# EAGLE design untitled (EAGLE 5.07)
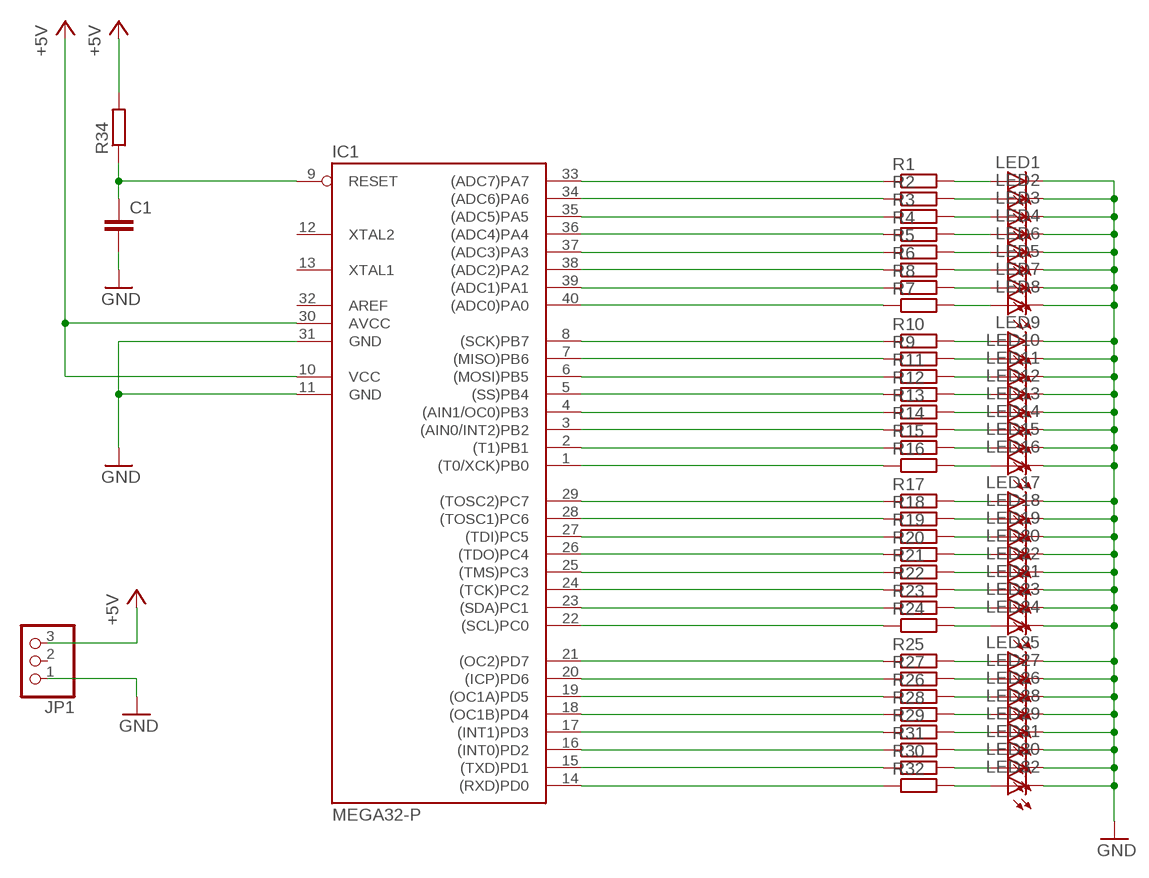
[diagram p0: schematic, sheet 1]

## Parts
C1  C-EU050-024X044  [C050-024X044]
IC1  MEGA32-P  [DIL40]
JP1  PINHD-1X3  [1X03]
LED1  LED5MM  [LED5MM]
LED2  LED5MM  [LED5MM]
LED3  LED5MM  [LED5MM]
LED4  LED5MM  [LED5MM]
LED5  LED5MM  [LED5MM]
LED6  LED5MM  [LED5MM]
LED7  LED5MM  [LED5MM]
LED8  LED5MM  [LED5MM]
LED9  LED5MM  [LED5MM]
LED10  LED5MM  [LED5MM]
LED11  LED5MM  [LED5MM]
LED12  LED5MM  [LED5MM]
LED13  LED5MM  [LED5MM]
LED14  LED5MM  [LED5MM]
LED15  LED5MM  [LED5MM]
LED16  LED5MM  [LED5MM]
LED17  LED5MM  [LED5MM]
LED18  LED5MM  [LED5MM]
LED19  LED5MM  [LED5MM]
LED20  LED5MM  [LED5MM]
LED21  LED5MM  [LED5MM]
LED22  LED5MM  [LED5MM]
LED23  LED5MM  [LED5MM]
LED24  LED5MM  [LED5MM]
LED25  LED5MM  [LED5MM]
LED26  LED5MM  [LED5MM]
LED27  LED5MM  [LED5MM]
LED28  LED5MM  [LED5MM]
LED29  LED5MM  [LED5MM]
LED30  LED5MM  [LED5MM]
LED31  LED5MM  [LED5MM]
LED32  LED5MM  [LED5MM]
R1  R-EU_0204/7  [0204/7]
R2  R-EU_0204/7  [0204/7]
R3  R-EU_0204/7  [0204/7]
R4  R-EU_0204/7  [0204/7]
R5  R-EU_0204/7  [0204/7]
R6  R-EU_0204/7  [0204/7]
R7  R-EU_0204/7  [0204/7]
R8  R-EU_0204/7  [0204/7]
R9  R-EU_0204/7  [0204/7]
R10  R-EU_0204/7  [0204/7]
R11  R-EU_0204/7  [0204/7]
R12  R-EU_0204/7  [0204/7]
R13  R-EU_0204/7  [0204/7]
R14  R-EU_0204/7  [0204/7]
R15  R-EU_0204/7  [0204/7]
R16  R-EU_0204/7  [0204/7]
R17  R-EU_0204/7  [0204/7]
R18  R-EU_0204/7  [0204/7]
R19  R-EU_0204/7  [0204/7]
R20  R-EU_0204/7  [0204/7]
R21  R-EU_0204/7  [0204/7]
R22  R-EU_0204/7  [0204/7]
R23  R-EU_0204/7  [0204/7]
R24  R-EU_0204/7  [0204/7]
R25  R-EU_0204/7  [0204/7]
R26  R-EU_0204/7  [0204/7]
R27  R-EU_0204/7  [0204/7]
R28  R-EU_0204/7  [0204/7]
R29  R-EU_0204/7  [0204/7]
R30  R-EU_0204/7  [0204/7]
R31  R-EU_0204/7  [0204/7]
R32  R-EU_0204/7  [0204/7]
R34  R-EU_0204/7  [0204/7]

## Nets
+5V: IC1.10(VCC) IC1.30(AVCC) JP1.3 R34.2
GND: C1.2 IC1.11(GND) IC1.31(GND) JP1.1 LED1.K(C) LED2.K(C) LED3.K(C) LED4.K(C) LED5.K(C) LED6.K(C) LED7.K(C) LED8.K(C) LED9.K(C) LED10.K(C) LED11.K(C) LED12.K(C) LED13.K(C) LED14.K(C) LED15.K(C) LED16.K(C) LED17.K(C) LED18.K(C) LED19.K(C) LED20.K(C) LED21.K(C) LED22.K(C) LED23.K(C) LED24.K(C) LED25.K(C) LED26.K(C) LED27.K(C) LED28.K(C) LED29.K(C) LED30.K(C) LED31.K(C) LED32.K(C)
N$1: LED32.A R32.2
N$2: LED30.A R30.2
N$3: LED31.A R31.2
N$4: LED29.A R29.2
N$5: LED28.A R28.2
N$6: LED26.A R26.2
N$7: LED27.A R27.2
N$8: LED25.A R25.2
N$9: LED24.A R24.2
N$10: LED23.A R23.2
N$11: LED21.A R22.2
N$12: LED22.A R21.2
N$13: LED20.A R20.2
N$14: LED19.A R19.2
N$15: LED18.A R18.2
N$16: LED17.A R17.2
N$17: LED16.A R16.2
N$18: LED15.A R15.2
N$19: LED14.A R14.2
N$20: LED13.A R13.2
N$21: LED12.A R12.2
N$22: LED11.A R11.2
N$23: LED10.A R9.2
N$24: LED9.A R10.2
N$25: LED8.A R7.2
N$26: LED7.A R8.2
N$27: LED5.A R6.2
N$28: LED6.A R5.2
N$29: LED4.A R4.2
N$30: LED3.A R3.2
N$31: LED2.A R2.2
N$32: LED1.A R1.2
N$33: IC1.33((ADC7)PA7) R1.1
N$34: IC1.34((ADC6)PA6) R2.1
N$35: IC1.35((ADC5)PA5) R3.1
N$36: IC1.36((ADC4)PA4) R4.1
N$37: IC1.37((ADC3)PA3) R5.1
N$38: IC1.38((ADC2)PA2) R6.1
N$39: IC1.39((ADC1)PA1) R8.1
N$40: IC1.40((ADC0)PA0) R7.1
N$41: IC1.8((SCK)PB7) R10.1
N$42: IC1.7((MISO)PB6) R9.1
N$43: IC1.6((MOSI)PB5) R11.1
N$44: IC1.5((SS)PB4) R12.1
N$45: IC1.4((AIN1/OC0)PB3) R13.1
N$46: IC1.3((AIN0/INT2)PB2) R14.1
N$47: IC1.2((T1)PB1) R15.1
N$48: IC1.1((T0/XCK)PB0) R16.1
N$49: IC1.29((TOSC2)PC7) R17.1
N$50: IC1.28((TOSC1)PC6) R18.1
N$51: IC1.27((TDI)PC5) R19.1
N$52: IC1.26((TDO)PC4) R20.1
N$53: IC1.25((TMS)PC3) R21.1
N$54: IC1.24((TCK)PC2) R22.1
N$55: IC1.23((SDA)PC1) R23.1
N$56: IC1.22((SCL)PC0) R24.1
N$57: IC1.21((OC2)PD7) R25.1
N$58: IC1.20((ICP)PD6) R27.1
N$59: IC1.19((OC1A)PD5) R26.1
N$60: IC1.18((OC1B)PD4) R28.1
N$61: IC1.17((INT1)PD3) R29.1
N$62: IC1.16((INT0)PD2) R31.1
N$63: IC1.15((TXD)PD1) R30.1
N$64: IC1.14((RXD)PD0) R32.1
N$65: C1.1 IC1.9(RESET) R34.1
Unconnected: IC1.12(XTAL2) IC1.13(XTAL1) IC1.32(AREF) JP1.2

## Library data of the parts
C1 = rcl:C-EU: CAPACITOR, European symbol
IC1 = atmel:MEGA32-P: MICROCONTROLLER 32 Kbytes FLASH 2 Kbytes SRAM 1 Kbytes EEPROM USART 8-channel 10 bit ADC Source: www.atmel.com .. doc2503.pdf
JP1 = pinhead:PINHD-1X3: PIN HEADER
LED1-LED32 = led:LED: LED OSRAM: - CHIPLED LG R971, LG N971, LY N971, LG Q971, LY Q971, LO R971, LY R971 LH N974, LH R974 LS Q976, LO Q976, LY Q976 LO Q996 - Hyper CHIPLED LW Q18S LB Q993, LB Q99A, LB R99A - SideLED LS A670, LO A670, LY A670, LG A670, LP A670 LB A673, LV A673, LT A673, LW A673 LH A674 LY A675 LS A676, LA A676, LO A676, LY A676, LW A676 LS A679, LY A679, LG A679 - Hyper Micro SIDELED® LS Y876, LA Y876, LO Y876, LY Y876 LT Y87S - SmartLED LW L88C, LW L88S LB L89C, LB L89S, LG L890 LS L89K, LO L89K, LY L89K LS L896, LA L896, LO L896, LY L896 - TOPLED LS T670, LO T670, LY T670, LG T670, LP T670 LSG T670, LSP T670, LSY T670, LOP T670, LYG T670 LG T671, LOG T671, LSG T671 LB T673, LV T673, LT T673, LW T673 LH T674 LS T676, LA T676, LO T676, LY T676, LB T676, LH T676, LSB T676, LW T676 LB T67C, LV T67C, LT T67C, LS T67K, LO T67K, LY T67K, LW E67C LS E67B, LA E67B, LO E67B, LY E67B, LB E67C, LV E67C, LT E67C LW T67C LS T679, LY T679, LG T679 LS T770, LO T770, LY T770, LG T770, LP T770 LB T773, LV T773, LT T773, LW T773 LH T774 LS E675, LA E675, LY E675, LS T675 LS T776, LA T776, LO T776, LY T776, LB T776 LHGB T686 LT T68C, LB T68C - Hyper Mini TOPLED® LB M676 - Mini TOPLED Santana® LG M470 LS M47K, LO M47K, LY M47K Source: http://www.osram.convergy.de LUXEON: - LUMILED® LXK2-PW12-R00, LXK2-PW12-S00, LXK2-PW14-U00, LXK2-PW14-V00 LXK2-PM12-R00, LXK2-PM12-S00, LXK2-PM14-U00 LXK2-PE12-Q00, LXK2-PE12-R00, LXK2-PE12-S00, LXK2-PE14-T00, LXK2-PE14-U00 LXK2-PB12-K00, LXK2-PB12-L00, LXK2-PB12-M00, LXK2-PB14-N00, LXK2-PB14-P00, LXK2-PB14-Q00 LXK2-PR12-L00, LXK2-PR12-M00, LXK2-PR14-Q00, LXK2-PR14-R00 LXK2-PD12-Q00, LXK2-PD12-R00, LXK2-PD12-S00 LXK2-PH12-R00, LXK2-PH12-S00 LXK2-PL12-P00, LXK2-PL12-Q00, LXK2-PL12-R00 Source: www.luxeon.com KINGBRIGHT: KA-3528ASYC Source: www.kingbright.com
R1-R32 R34 = rcl:R-EU_: RESISTOR, European symbol

## Board
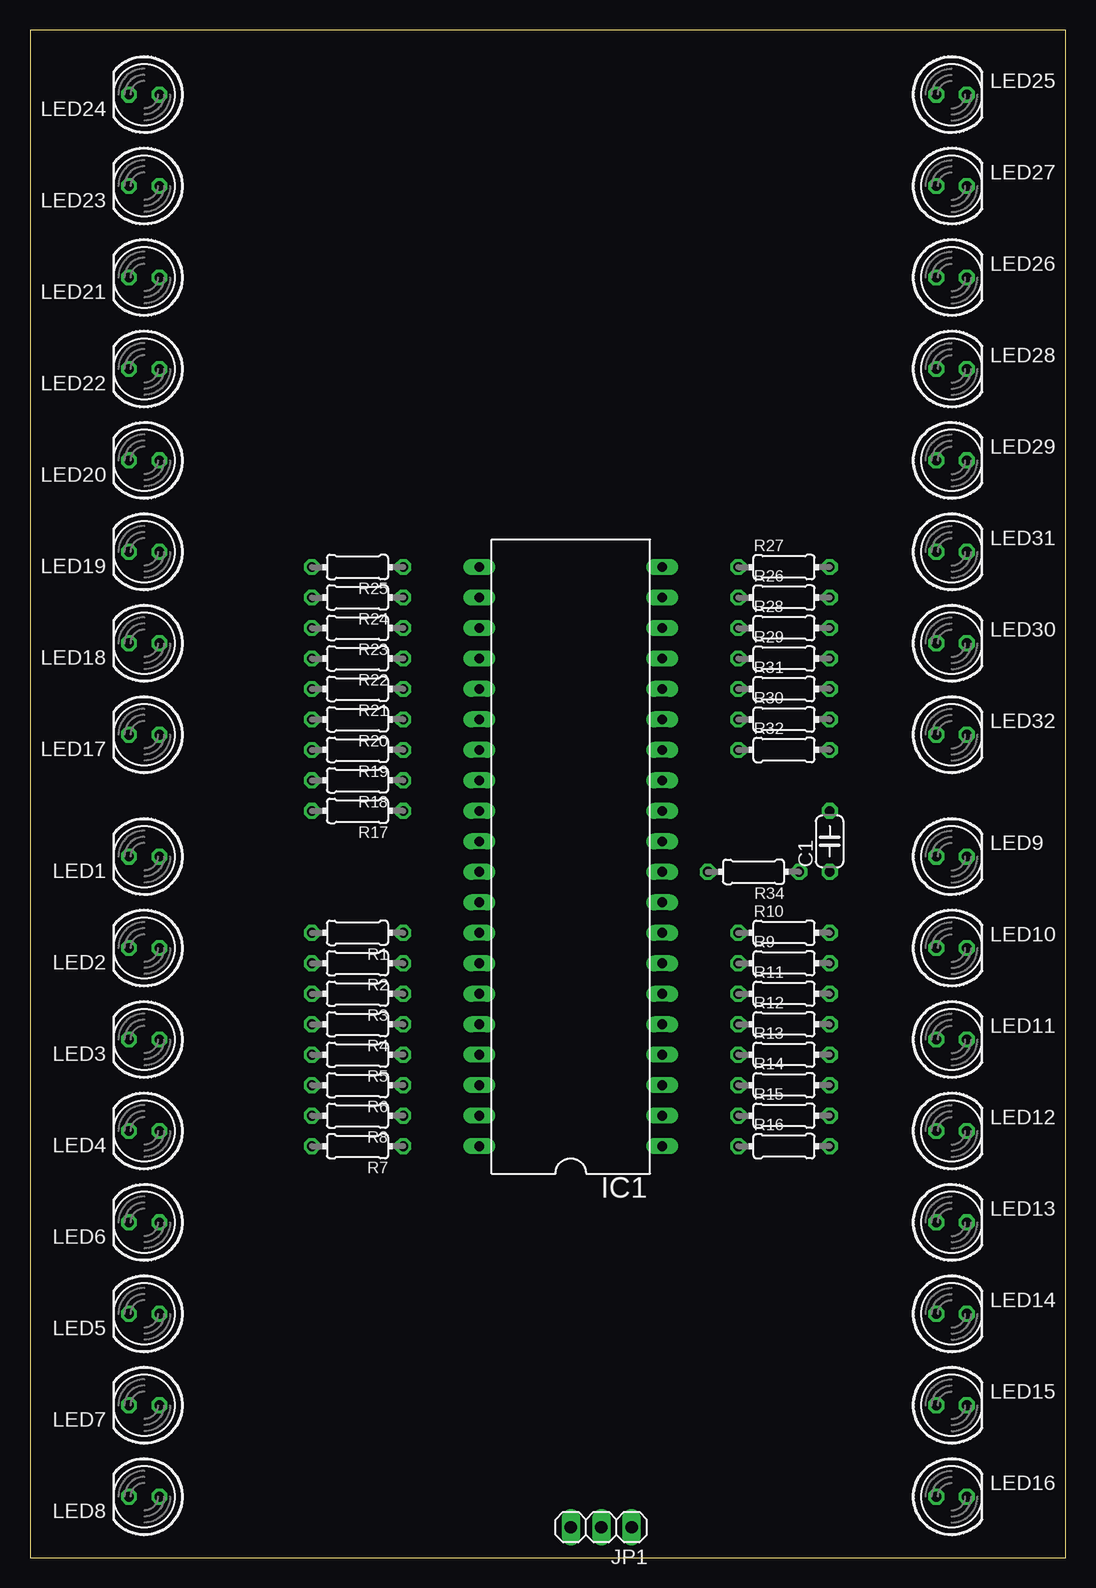
[diagram p1: board, top side]
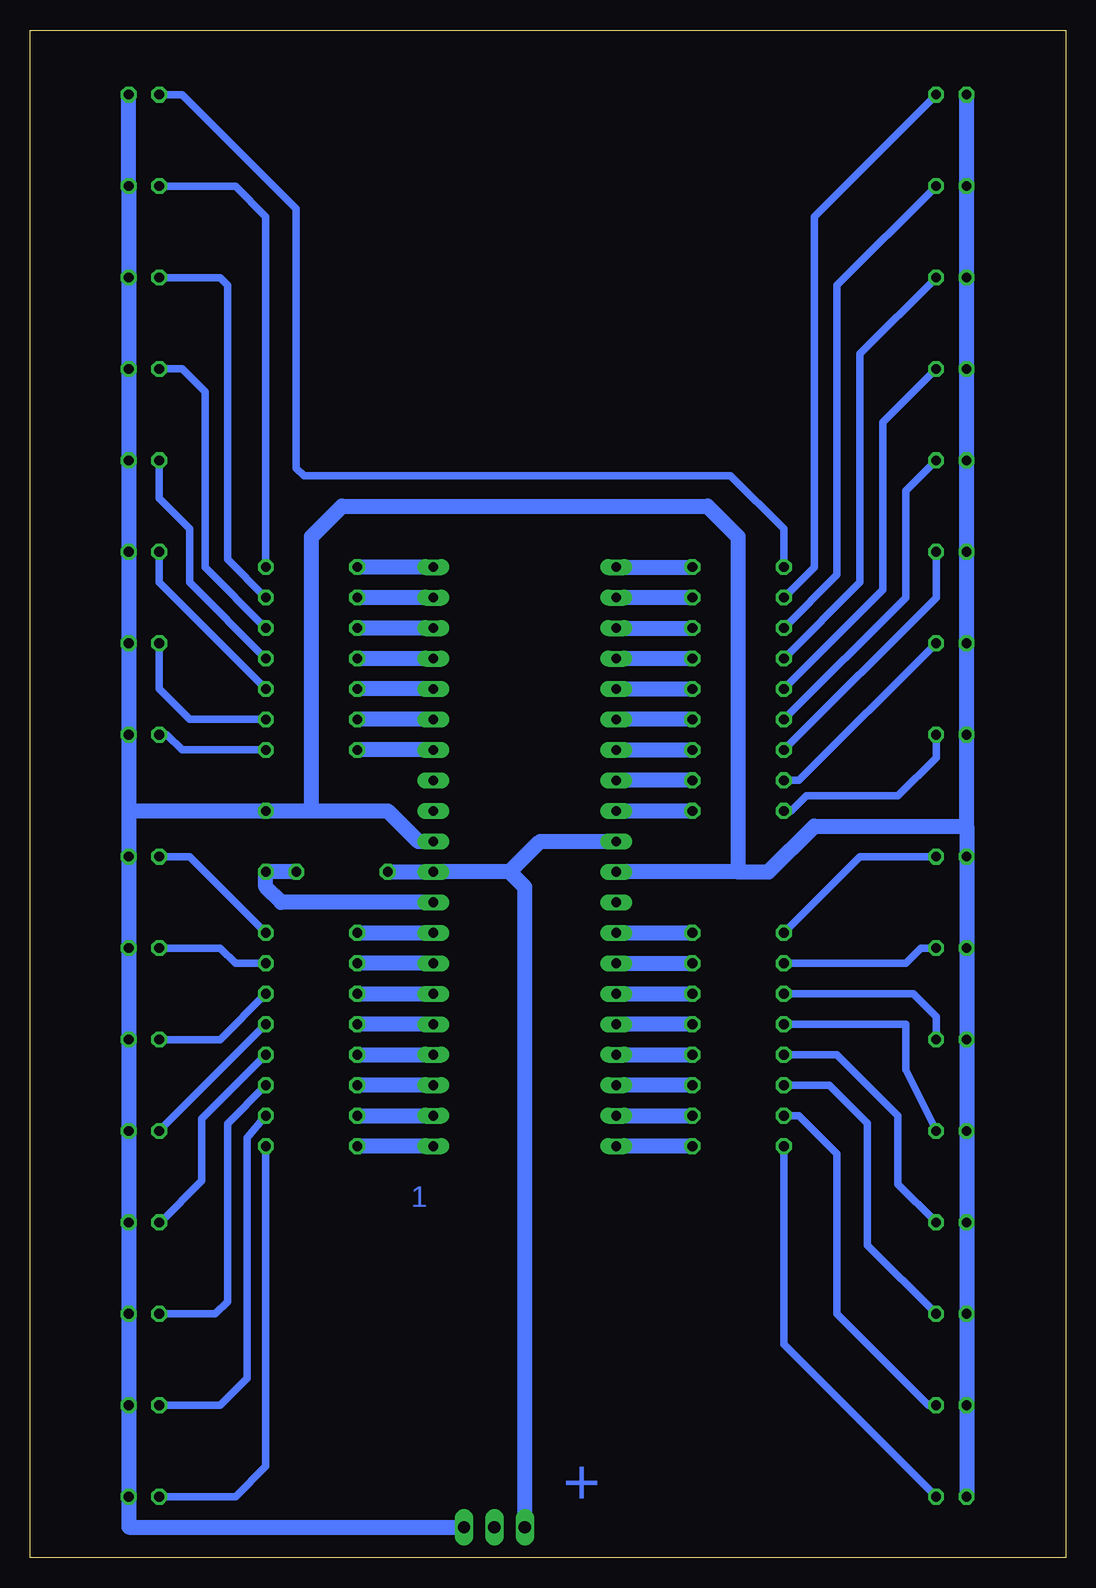
[diagram p2: board, bottom side, seen from below]

Size 86.34 x 127.31 mm. Coordinates in mm from the lower left corner, seen from the top.
Outline: 0,0 86.34,0 86.34,127.31 0,127.31 0,0
Copper layers (1*16): Top 0.035mm / dielectric 1.5mm / Bottom 0.035mm
Design rules "default *": minimum track width 10mil, minimum drill 24mil, track to track 12mil, track to pad 8mil, pad to pad 8mil, via to via 8mil, smd to smd 8mil, copper to edge 40mil, drill to drill 8mil, minimum pad ring 10mil, minimum via ring 8mil, stop-mask expansion 4mil, vias tented up to drill 0mil, thermal gap 10mil

### Footprints (pad centres in the part's own frame; a part is rotated, then mirrored left to right if it is on the bottom)
C050-024X044 = drill 0.813 octagon: 1 -2.54,0; 2 2.54,0
DIL40 = drill 0.813 long: 1 -24.13,-7.62; 2 -21.59,-7.62; 3 -19.05,-7.62; 4 -16.51,-7.62; 5 -13.97,-7.62; 6 -11.43,-7.62; 7 -8.89,-7.62; 8 -6.35,-7.62; 9 -3.81,-7.62; 10 -1.27,-7.62; 11 1.27,-7.62; 12 3.81,-7.62; 13 6.35,-7.62; 14 8.89,-7.62; 15 11.43,-7.62; 16 13.97,-7.62; 17 16.51,-7.62; 18 19.05,-7.62; 19 21.59,-7.62; 20 24.13,-7.62; 21 24.13,7.62; 22 21.59,7.62; 23 19.05,7.62; 24 16.51,7.62; 25 13.97,7.62; 26 11.43,7.62; 27 8.89,7.62; 28 6.35,7.62; 29 3.81,7.62; 30 1.27,7.62; 31 -1.27,7.62; 32 -3.81,7.62; 33 -6.35,7.62; 34 -8.89,7.62; 35 -11.43,7.62; 36 -13.97,7.62; 37 -16.51,7.62; 38 -19.05,7.62; 39 -21.59,7.62; 40 -24.13,7.62
1X03 = drill 1.016 long: 1 -2.54,0; 2 0,0; 3 2.54,0
LED5MM = drill 0.813 octagon: A -1.27,0; K 1.27,0
0204/7 = drill 0.813 octagon: 1 -3.81,0; 2 3.81,0

### Placement (x,y rotation side)
C1  66.67,59.69 90 top
IC1  45.09,58.42 90 top
JP1  47.62,2.54 180 top
LED1  9.53,58.42 180 top
LED2  9.53,50.8 180 top
LED3  9.53,43.18 180 top
LED4  9.53,35.56 180 top
LED5  9.53,20.32 180 top
LED6  9.53,27.94 180 top
LED7  9.53,12.7 180 top
LED8  9.53,5.08 180 top
LED9  76.83,58.42 0 top
LED10  76.83,50.8 0 top
LED11  76.83,43.18 0 top
LED12  76.83,35.56 0 top
LED13  76.83,27.94 0 top
LED14  76.83,20.32 0 top
LED15  76.83,12.7 0 top
LED16  76.83,5.08 0 top
LED17  9.53,68.58 180 top
LED18  9.53,76.2 180 top
LED19  9.53,83.82 180 top
LED20  9.53,91.44 180 top
LED21  9.53,106.68 180 top
LED22  9.53,99.06 180 top
LED23  9.53,114.3 180 top
LED24  9.53,121.92 180 top
LED25  76.83,121.92 0 top
LED26  76.83,106.68 0 top
LED27  76.83,114.3 0 top
LED28  76.83,99.06 0 top
LED29  76.83,91.44 0 top
LED30  76.83,76.2 0 top
LED31  76.83,83.82 0 top
LED32  76.83,68.58 0 top
R1  27.31,52.07 180 top
R2  27.31,49.53 180 top
R3  27.31,46.99 180 top
R4  27.31,44.45 180 top
R5  27.31,41.91 180 top
R6  27.31,39.37 180 top
R7  27.31,34.29 180 top
R8  27.31,36.83 180 top
R9  62.86,49.53 0 top
R10  62.86,52.07 0 top
R11  62.86,46.99 0 top
R12  62.86,44.45 0 top
R13  62.86,41.91 0 top
R14  62.86,39.37 0 top
R15  62.86,36.83 0 top
R16  62.86,34.29 0 top
R17  27.31,62.23 180 top
R18  27.31,64.77 180 top
R19  27.31,67.31 180 top
R20  27.31,69.85 180 top
R21  27.31,72.39 180 top
R22  27.31,74.93 180 top
R23  27.31,77.47 180 top
R24  27.31,80.01 180 top
R25  27.31,82.55 180 top
R26  62.86,80.01 0 top
R27  62.86,82.55 0 top
R28  62.86,77.47 0 top
R29  62.86,74.93 0 top
R30  62.86,69.85 0 top
R31  62.86,72.39 0 top
R32  62.86,67.31 0 top
R34  60.33,57.15 180 top

### Tracks (layer width: path | path; a pad name or v marks a point on that pad's centre or on a via)
+5V
  Bottom 1.27: 46.36,57.15 IC1.10 R34.2 | 46.36,57.15 43.81,59.69 IC1.30 | JP1.3 45.09,55.88 46.36,57.15
GND
  Bottom 1.27: 78.11,62.23 LED32.K LED30.K LED31.K LED29.K LED28.K LED26.K LED27.K LED25.K | 78.11,62.23 LED9.K LED10.K LED11.K LED12.K LED13.K LED14.K LED15.K LED16.K 78.11,2.54 JP1.1 | LED24.K LED23.K LED21.K LED22.K LED20.K LED19.K LED18.K LED17.K 8.26,60.96 | 8.26,60.96 LED1.K LED2.K LED3.K LED4.K LED6.K LED5.K LED7.K LED8.K | 27.31,57.15 24.77,57.15 20.95,60.96 8.26,60.96 | 27.31,57.15 IC1.31 | 62.86,62.23 C1.2 78.11,62.23 | IC1.11 53.98,59.69 56.52,62.23 62.86,62.23 | 62.86,62.23 62.86,85.09 60.33,87.63 29.84,87.63 27.31,85.09 27.31,57.15
N$1
  Bottom 0.61: LED32.A 74.93,68.58 73.66,67.31 R32.2
N$2
  Bottom 0.61: LED30.A 75.57,72.39 73.02,69.85 R30.2
N$3
  Bottom 0.61: LED31.A 75.57,81.28 R31.2
N$4
  Bottom 0.61: LED29.A 75.57,88.27 73.02,85.72 73.02,81.28 R29.2
N$5
  Bottom 0.61: LED28.A 73.66,99.06 71.76,97.16 71.76,82.55 R28.2
N$6
  Bottom 0.61: LED26.A 70.48,106.68 69.85,106.05 69.85,83.19 R26.2
N$7
  Bottom 0.61: LED27.A 69.21,114.3 66.67,111.76 R27.2
N$8
  Bottom 0.61: LED25.A 73.66,121.92 64.14,112.39 64.14,90.81 63.5,90.17 27.94,90.17 23.5,85.72 R25.2
N$9
  Bottom 0.61: R24.2 20.95,82.55 20.95,111.76 LED24.A
N$10
  Bottom 0.61: R23.2 19.05,81.92 19.05,106.05 LED23.A
N$11
  Bottom 0.61: R22.2 17.14,81.28 17.14,100.33 LED21.A
N$12
  Bottom 0.61: R21.2 15.24,80.64 15.24,94.61 LED22.A
N$13
  Bottom 0.61: R20.2 13.34,80.01 13.34,88.9 LED20.A
N$14
  Bottom 0.61: R19.2 10.8,80.01 LED19.A
N$15
  Bottom 0.61: R18.2 22.23,64.77 LED18.A
N$16
  Bottom 0.61: R17.2 22.86,62.23 21.59,63.5 13.97,63.5 10.8,66.67 LED17.A
N$17
  Bottom 0.61: LED16.A 69.21,5.08 66.67,7.62 R16.2
N$18
  Bottom 0.61: LED15.A 70.48,12.7 68.25,14.94 68.25,35 R15.2
N$19
  Bottom 0.61: LED14.A 70.89,20.32 69.88,21.34 69.88,36.17 R14.2
N$20
  Bottom 0.61: LED13.A 75.46,27.94 72.01,31.39 72.01,36.58 R13.2
N$21
  Bottom 0.61: LED12.A R12.2
N$22
  Bottom 0.61: LED11.A 70.48,43.18 R11.2
N$23
  Bottom 0.61: LED10.A 70.48,50.8 69.21,49.53 R9.2
N$24
  Bottom 0.61: LED9.A 73.02,58.42 R10.2
N$25
  Bottom 0.61: R7.2 23.5,17.78 LED8.A
N$26
  Bottom 0.61: R8.2 22.23,36.83 19.05,33.66 19.05,20.32 11.43,12.7 LED7.A
N$27
  Bottom 0.61: R6.2 19.69,39.37 16.51,36.2 16.51,26.04 LED5.A
N$28
  Bottom 0.61: R5.2 19.05,41.91 13.97,36.83 13.97,31.11 LED6.A
N$29
  Bottom 0.61: R4.2 13.34,44.45 13.34,40.64 LED4.A
N$30
  Bottom 0.61: LED3.A 10.8,45.09 12.7,46.99 R3.2
N$31
  Bottom 0.61: LED2.A 12.06,50.8 13.34,49.53 R2.2
N$32
  Bottom 0.61: LED1.A 17.14,58.42 R1.2
N$33
  Bottom 1.27: IC1.33 R1.1
N$34
  Bottom 1.27: IC1.34 R2.1
N$35
  Bottom 1.27: IC1.35 R3.1
N$36
  Bottom 1.27: R4.1 IC1.36
N$37
  Bottom 1.27: IC1.37 R5.1
N$38
  Bottom 1.27: R6.1 IC1.38
N$39
  Bottom 1.27: IC1.39 R8.1
N$40
  Bottom 1.27: R7.1 IC1.40
N$41
  Bottom 1.27: R10.1 IC1.8
N$42
  Bottom 1.27: IC1.7 R9.1
N$43
  Bottom 1.27: R11.1 IC1.6
N$44
  Bottom 1.27: IC1.5 R12.1
N$45
  Bottom 1.27: R13.1 IC1.4
N$46
  Bottom 1.27: IC1.3 R14.1
N$47
  Bottom 1.27: R15.1 IC1.2
N$48
  Bottom 1.27: IC1.1 R16.1
N$49
  Bottom 1.27: IC1.29 R17.1
N$50
  Bottom 1.27: R18.1 IC1.28
N$51
  Bottom 1.27: IC1.27 R19.1
N$52
  Bottom 1.27: R20.1 IC1.26
N$53
  Bottom 1.27: IC1.25 R21.1
N$54
  Bottom 1.27: R22.1 IC1.24
N$55
  Bottom 1.27: IC1.23 R23.1
N$56
  Bottom 1.27: R24.1 IC1.22
N$57
  Bottom 1.27: IC1.21 R25.1
N$58
  Bottom 1.27: IC1.20 R27.1
N$59
  Bottom 1.27: IC1.19 R26.1
N$60
  Bottom 1.27: IC1.18 R28.1
N$61
  Bottom 1.27: IC1.17 R29.1
N$62
  Bottom 1.27: IC1.16 R31.1
N$63
  Bottom 1.27: IC1.15 R30.1
N$64
  Bottom 1.27: IC1.14 R32.1
N$65
  Bottom 1.27: IC1.9 65.41,54.61 66.67,55.88 C1.1 R34.1

### Text on the board
Bottom: 1 | +